# Altium schematic sheet CAN_RS232.SchDoc
size 431 x 279 mm; SheetNumber: 2; SheetTotal: 3
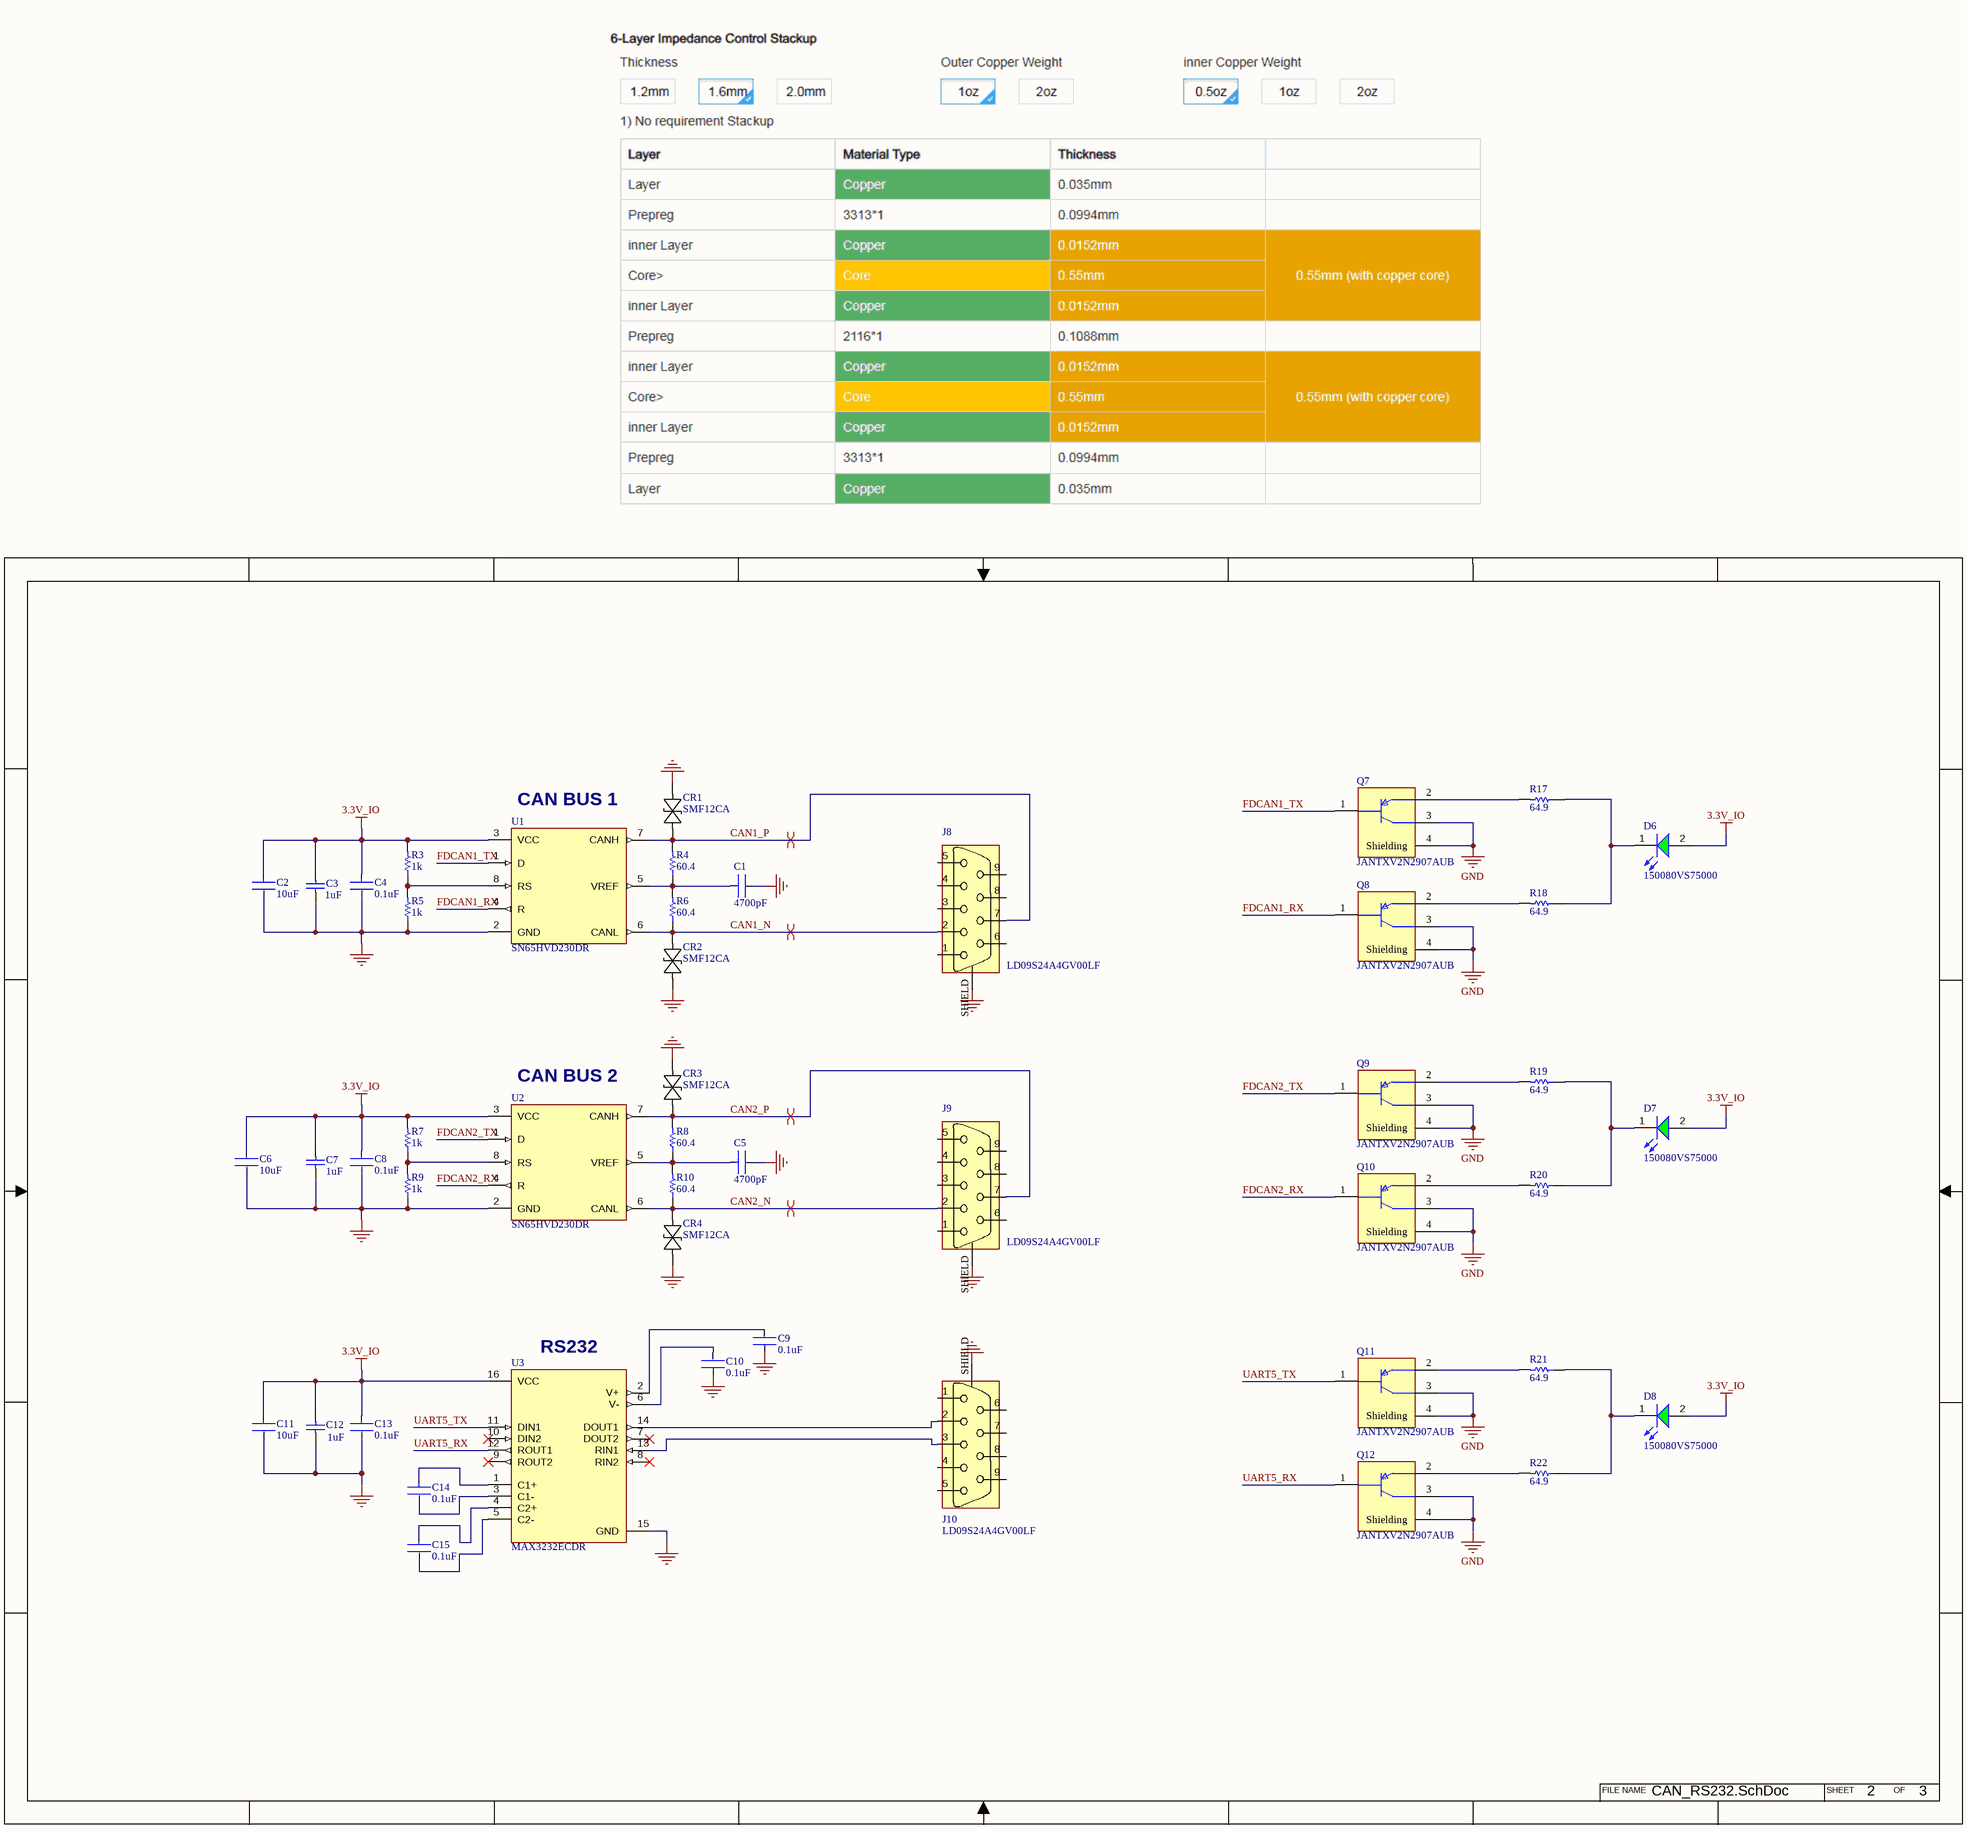
[diagram p0: CAN_RS232.SchDoc]

## Parts
C1  4700pF  [FP-CC0805-0_85-MFG]
C2  10uF  [FP-CL31-IPC_B]
C3  1uF  [CAPC2013X100X50ML20T25]
C4  0.1uF  [FP-CC0805-0_85-MFG]
C5  4700pF  [FP-CC0805-0_85-MFG]
C6  10uF  [FP-CL31-IPC_B]
C7  1uF  [CAPC2013X100X50ML20T25]
C8  0.1uF  [FP-CC0805-0_85-MFG]
C9  0.1uF  [FP-CC0805-0_85-MFG]
C10  0.1uF  [FP-CC0805-0_85-MFG]
C11  10uF  [FP-CL31-IPC_B]
C12  1uF  [CAPC2013X100X50ML20T25]
C13  0.1uF  [FP-CC0805-0_85-MFG]
C14  0.1uF  [FP-CC0805-0_85-MFG]
C15  0.1uF  [FP-CC0805-0_85-MFG]
CR1  SMF12CA  [SOD-123F_LTF]
CR2  SMF12CA  [SOD-123F_LTF]
CR3  SMF12CA  [SOD-123F_LTF]
CR4  SMF12CA  [SOD-123F_LTF]
D6  150080VS75000  [WL-SMCW_0805_150080xx75000]
D7  150080VS75000  [WL-SMCW_0805_150080xx75000]
D8  150080VS75000  [WL-SMCW_0805_150080xx75000]
J8  LD09S24A4GV00LF  [ASSMANN_A-DF09A/KG-T2S]
J9  LD09S24A4GV00LF  [ASSMANN_A-DF09A/KG-T2S]
J10  LD09S24A4GV00LF  [ASSMANN_A-DF09A/KG-T2S]
Q7  JANTXV2N2907AUB  [FP-UB-IPC_C]
Q8  JANTXV2N2907AUB  [FP-UB-IPC_C]
Q9  JANTXV2N2907AUB  [FP-UB-IPC_C]
Q10  JANTXV2N2907AUB  [FP-UB-IPC_C]
Q11  JANTXV2N2907AUB  [FP-UB-IPC_C]
Q12  JANTXV2N2907AUB  [FP-UB-IPC_C]
R3  1k  [RESC2013X60X35ML10T20]
R4  60.4  [RESC2013X60X35LL10T20]
R5  1k  [RESC2013X60X35ML10T20]
R6  60.4  [RESC2013X60X35LL10T20]
R7  1k  [RESC2013X60X35ML10T20]
R8  60.4  [RESC2013X60X35LL10T20]
R9  1k  [RESC2013X60X35ML10T20]
R10  60.4  [RESC2013X60X35LL10T20]
R17  64.9  [RESC2013X60X35LL10T20]
R18  64.9  [RESC2013X60X35LL10T20]
R19  64.9  [RESC2013X60X35LL10T20]
R20  64.9  [RESC2013X60X35LL10T20]
R21  64.9  [RESC2013X60X35LL10T20]
R22  64.9  [RESC2013X60X35LL10T20]
U1  SN65HVD230DR  [SOIC127P599X175-8N]
U2  SN65HVD230DR  [SOIC127P599X175-8N]
U3  MAX3232ECDR  [SOIC127P600X175-16N]

## Nets
3.3V_IO: C2.1 C3.2 C4.1 C6.1 C7.2 C8.1 C11.1 C12.2 C13.1 D6.2(A) D7.2(A) D8.2(A) R3.2 R7.2 U1.3(VCC) U2.3(VCC) U3.16(VCC)
GND: C1.2 C2.2 C3.1 C4.2 C5.2 C6.2 C7.1 C8.2 C9.1 C10.1 C11.2 C12.1 C13.2 CR1.1 CR2.1 CR3.2 CR4.2 J8.SHIELD J9.SHIELD J10.SHIELD Q7.3(C) Q7.4(Shielding) Q8.3(C) Q8.4(Shielding) Q9.3(C) Q9.4(Shielding) Q10.3(C) Q10.4(Shielding) Q11.3(C) Q11.4(Shielding) Q12.3(C) Q12.4(Shielding) R5.1 R9.1 U1.2(GND) U2.2(GND) U3.15(GND)
CAN1_N: CR2.2 J8.2 R6.1 U1.6(CANL)
CAN1_P: CR1.2 J8.7 R4.2 U1.7(CANH)
CAN2_N: CR4.1 J9.2 R10.1 U2.6(CANL)
CAN2_P: CR3.1 J9.7 R8.2 U2.7(CANH)
FDCAN1_RX: Q8.1(B) U1.4(R)
FDCAN1_TX: Q7.1(B) U1.1(D)
FDCAN2_RX: Q10.1(B) U2.4(R)
FDCAN2_TX: Q9.1(B) U2.1(D)
UART5_RX: Q12.1(B) U3.12(ROUT1)
UART5_TX: Q11.1(B) U3.11(DIN1)
NetC1_1: C1.1 R4.1 R6.2 U1.5(VREF)
NetC5_1: C5.1 R8.1 R10.2 U2.5(VREF)
NetC9_2: C9.2 U3.2(V+)
NetC10_2: C10.2 U3.6(V-)
NetC14_1: C14.1 U3.1(C1+)
NetC14_2: C14.2 U3.3(C1-)
NetC15_1: C15.1 U3.4(C2+)
NetC15_2: C15.2 U3.5(C2-)
NetD6_1: D6.1(K) R17.1 R18.1
NetD7_1: D7.1(K) R19.1 R20.1
NetD8_1: D8.1(K) R21.1 R22.1
NetJ10_2: J10.2 U3.14(DOUT1)
NetJ10_3: J10.3 U3.13(RIN1)
NetQ7_2: Q7.2(E) R17.2
NetQ8_2: Q8.2(E) R18.2
NetQ9_2: Q9.2(E) R19.2
NetQ10_2: Q10.2(E) R20.2
NetQ11_2: Q11.2(E) R21.2
NetQ12_2: Q12.2(E) R22.2
NetR3_1: R3.1 R5.2 U1.8(RS)
NetR7_1: R7.1 R9.2 U2.8(RS)

Not connected (* = marked no-connect by the designer): J8 1 3 4 5 6 8 9; J9 1 3 4 5 6 8 9; J10 1 4 5 6 7 8 9; U3 7(DOUT2)* 8(RIN2)* 9(ROUT2)* 10(DIN2)*

## Layout directives
differential pair: CAN1_N, CAN1_P, CAN2_N, CAN2_P

## Notes on the sheet
- (near U1) CAN BUS 1
- (near U2) CAN BUS 2
- (near U3) RS232
- CAN_RS232.SchDoc
- 2
- 3
- FILE NAME
- SHEET
- OF

## Library data of the parts
C1 C5 = CMP-1036-03591-2: CAP CER 4700PF 50V X7R 0805; Manufacturer: Yageo; Manufacturer Part Number: CC0805KRX7R9BB472; Tolerance: 0.1; Capacitance: 4.7 nF; Value: 4.7 nF; Material: Ceramic; Device Class L1: Passive Components; Voltage Rating: 50 V; ComponentLink2URL: http://www.yageo.com/documents/recent/UPY-GPHC_Y5V_6.3V-to-50V_8.pdf; Device Class L3: Ceramic Capacitors; Temperature: -30°C to +85°C; Height: 0.95mm; Package: CC0805-0.85; Digikey Description: CAP CER 4700PF 50V X7R 0805; Ipc Land Pattern Name: CAPC200125X85; Device Class L2: Capacitors; Temperature Range High: +85°C; Mouser Description: Multilayer Ceramic Capacitors MLCC - SMD/SMT 4.7nF 50V X7R 10%; Lead Free: Yes; Category: Cap; Temperature Range Low: -30°C; Octopart: https://octopart.com/cc0805krx7r9bb472-yageo-192986; Automotive: No; RoHS: TRUE; Temperature Characteristic: X7R; ComponentLink2Description: Datasheet; Footprint Url: http://www.yageo.com/exep/pages/download/literatures/UPY-C_GEN_24.pdf
C2 C6 C11 = CMP-13271-001434-1: Cap Ceramic 10uF 25V X7R ±10% SMD 1206 +125°C Embossed T/R; Max Operating Temperature: 125°C; Dielectric: X7R; Voltage Rating: 25V; Tolerance: 10%; Min Operating Temperature: -55°C; Height: 1.6mm; Mount: Surface Mount; Width: 0.063inch; Thickness: 0.071inch; Case Code (Metric): 3216; Contact Plating: Tin; Packaging: Tape and Reel; Case/Package: 1206; Value: 10uF; Case Code (Imperial): 1206; Length: 0.126inch; Radiation Hardening: No; Package Quantity: 1; Depth: 1.6mm
C3 = CMP-2007-03676-1: C0805C105K8RACTU; Manufacturer: Kemet; Part Number: C0805C105K8RACTU
C4 C8-C10 C13-C15 = CMP-2100-03606-3: CAP CER 0.1UF 50V X7R 0805; Manufacturer Part Number: CC0805KRX7R9BB104; Manufacturer: Yageo; Tolerance: 0.1; Capacitance: 100 nF; Value: 100 nF; Material: Ceramic; Device Class L1: Passive Components; ComponentLink2Description: Datasheet; Package: CC0805-0.85; Digikey Description: CAP CER 0.1UF 50V X7R 0805; Device Class L3: Ceramic Capacitors; Temperature: -30°C to +85°C; Temperature Characteristic: X7R; Voltage Rating: 50 V; Height: 0.95mm; RoHS: TRUE; Ipc Land Pattern Name: CAPC200125X85; Device Class L2: Capacitors; Category: Cap; Temperature Range Low: -30°C; Temperature Range High: +85°C; Mouser Description: Multilayer Ceramic Capacitors MLCC - SMD/SMT 100nF 50V X7R 10%; Footprint Url: http://www.yageo.com/exep/pages/download/literatures/UPY-C_GEN_24.pdf; Automotive: No; Octopart: https://octopart.com/cc0805krx7r9bb104-yageo-192993; Lead Free: Yes; ComponentLink2URL: http://www.yageo.com/documents/recent/UPY-GPHC_Y5V_6.3V-to-50V_8.pdf
C7 C12 = CMP-2007-03676-1: Part Number: C0805C105K8RACTU; Manufacturer: Kemet
CR1-CR4 = SMF12CA: No Description Available; Mfr_Name: Littelfuse Inc
D6-D8 = CMP-1426-00009-6: WL-SMCW SMT Mono-Color Chip LED Waterclear; Max Junction Temperature (Tj): 95°C; Max Reverse Voltage (DC): 5V; Luminous Intensity: 40mcd; Color: Green; Peak Wavelength: 572nm; Wavelength: 570nm; Viewing Angle: 140°; Power Dissipation: 72mW; Forward Current: 100mA; Test Current: 20mA; Forward Voltage: 2V; Lens Style: Clear, Rectangular; Reverse Voltage: 5V; Length: 2mm; RoHS: Compliant; Min Operating Temperature: -40°C; REACH SVHC: Unknown; Packaging: Tape and Reel; Case/Package: 0805; Max Operating Temperature: 85°C; Case Code (Metric): 2012; Width: 1.25mm; Dominant Wavelength: 570nm; Mount: Surface Mount; Case Code (Imperial): 0805; Height: 700µm
J8-J10 = LD09S24A4GV00LF: No Description Available; Mfr_Name: Amphenol ICC; Type: D-Sub Connector Assemblies; RefDes: RefDes
Q7-Q12 = CMP-06366-000007-1: TRANS PNP 60V 0.6A 4UB
R3 R5 R7 R9 = CMP-2100-03671-1: Chip Resistor, 1 KOhm, +/- 1%, 125 mW, -55 to 155 degC, 0805 (2012 Metric), RoHS, Tape and Reel; Manufacturer: Yageo; Temperature Coefficient: 100ppm/degreesC; Voltage Rating (DC): 150V; Max Power Dissipation: 125mW; Resistance: 1KOhm; Number of Pins: 2; Number of Terminations: 2; Datasheet URL: http://www.yageo.com/NewPortal/yageodocoutput?fileName=/pdf/R-Chip/PYu-RC_Group_51_RoHS_L_5.pdf; Length: 0.079inch; Package Description: 2-Pin Surface Mounted Device, Body 2 x 1.25 mm; Depth: 1.25mm; Height: 0.024inch; Military Standard: Not; Case/Package: 0805; Package Reference: 0805; RoHSCompliant: true; Lead Free: LeadFree; Packaging: TapeandReel; Package Quantity: 1; Datasheet Version: Rev. 5, 10/2016; Tolerance: 1%; Min Operating Temperature: -55degC; Voltage Rating: 150V; Composition: ThickFilm; Case Code (Imperial): 0805; Power Rating: 125mW; Width: 0.049inch; Case Code (Metric): 2012; Manufacturer URL: http://www.yageo.com/; Max Operating Temperature: 155degC; REACH SVHC: Unknown; Termination: SMD/SMT
R4 R6 R8 R10 = CMP-2001-01223-1: Part Number: RC0805FR-0760R4L; Manufacturer: Yageo
R17-R22 = CMP-2001-01223-1: Part Number: RC0805FR-0764R9L; Manufacturer: Yageo
U1 U2 = SN65HVD230DR: 3.3 V CAN Transceiver with Standby Mode 8-SOIC -40 to 85; MF: Texas Instruments; Package: SOIC-8 Texas Instruments; DigiKey-Purchase-URL: https://snapeda.com/shop?store=DigiKey&id=51767; MP: SN65HVD230DR; Mouser-Purchase-URL: https://snapeda.com/shop?store=Mouser&id=51767; Value: *; Arrow_Electronics-Purchase-URL: https://snapeda.com/shop?store=Arrow+Electronics&id=51767; Availability: Good; SnapEDA_Link: https://www.snapeda.com/parts/SN65HVD230DR/Texas%20Instruments/view-part/51767/?ref=snap; Price: None; Texas_Instruments-Purchase-URL: https://snapeda.com/shop?store=Texas+Instruments&id=51767
U3 = MAX3232ECDR: 3-V to 5.5-V multichannel RS-232 line driver and receiver with 15-kV IEC ESD protection 16-SOIC 0 to 70; Price: None; MP: MAX3232ECDR; Availability: Unavailable; Package: None; Value: *